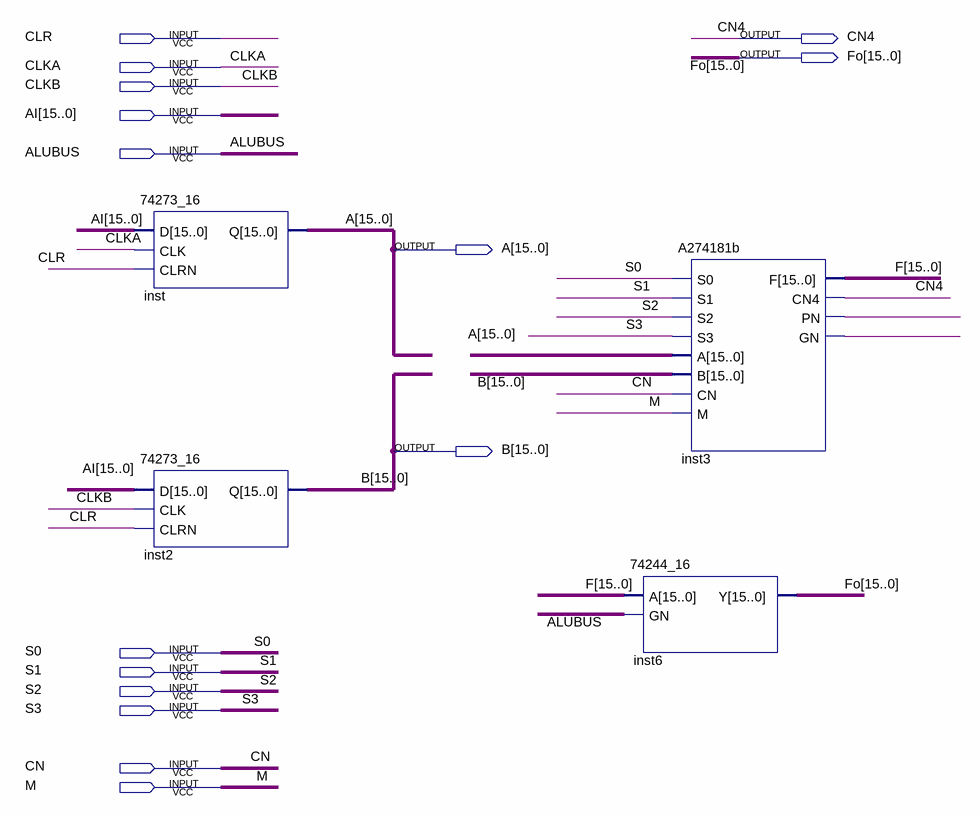
[diagram p0: schematic sheet]
// Quartus schematic A2ADD16b.bdf as structural Verilog: 4 symbols, 15 pins
module A2ADD16b (
  input  CLR,
  input  CLKA,
  input  CLKB,
  input  [15:0] AI,
  input  ALUBUS,
  input  S0,
  input  S1,
  input  S2,
  input  S3,
  input  CN,
  input  M,
  output CN4,
  output [15:0] Fo,
  output [15:0] A,
  output [15:0] B
);

  wire inst3_gn, inst3_pn;
  wire [15:0] F;

  \74273_16  inst (.D(AI), .CLK(CLKA), .CLRN(CLR), .Q(A));
  \74273_16  inst2 (.D(AI), .CLK(CLKB), .CLRN(CLR), .Q(B));
  \74244_16  inst6 (.A(F), .GN(ALUBUS), .Y(Fo));
  A274181b inst3 (
    .S0(S0), .S1(S1), .S2(S2), .S3(S3), .A(A), .B(B), .CN(CN), .M(M), .F(F), .CN4(CN4), .PN(inst3_pn),
    .GN(inst3_gn));
endmodule
